# Altium schematic sheet keyboard.SchDoc
size A1
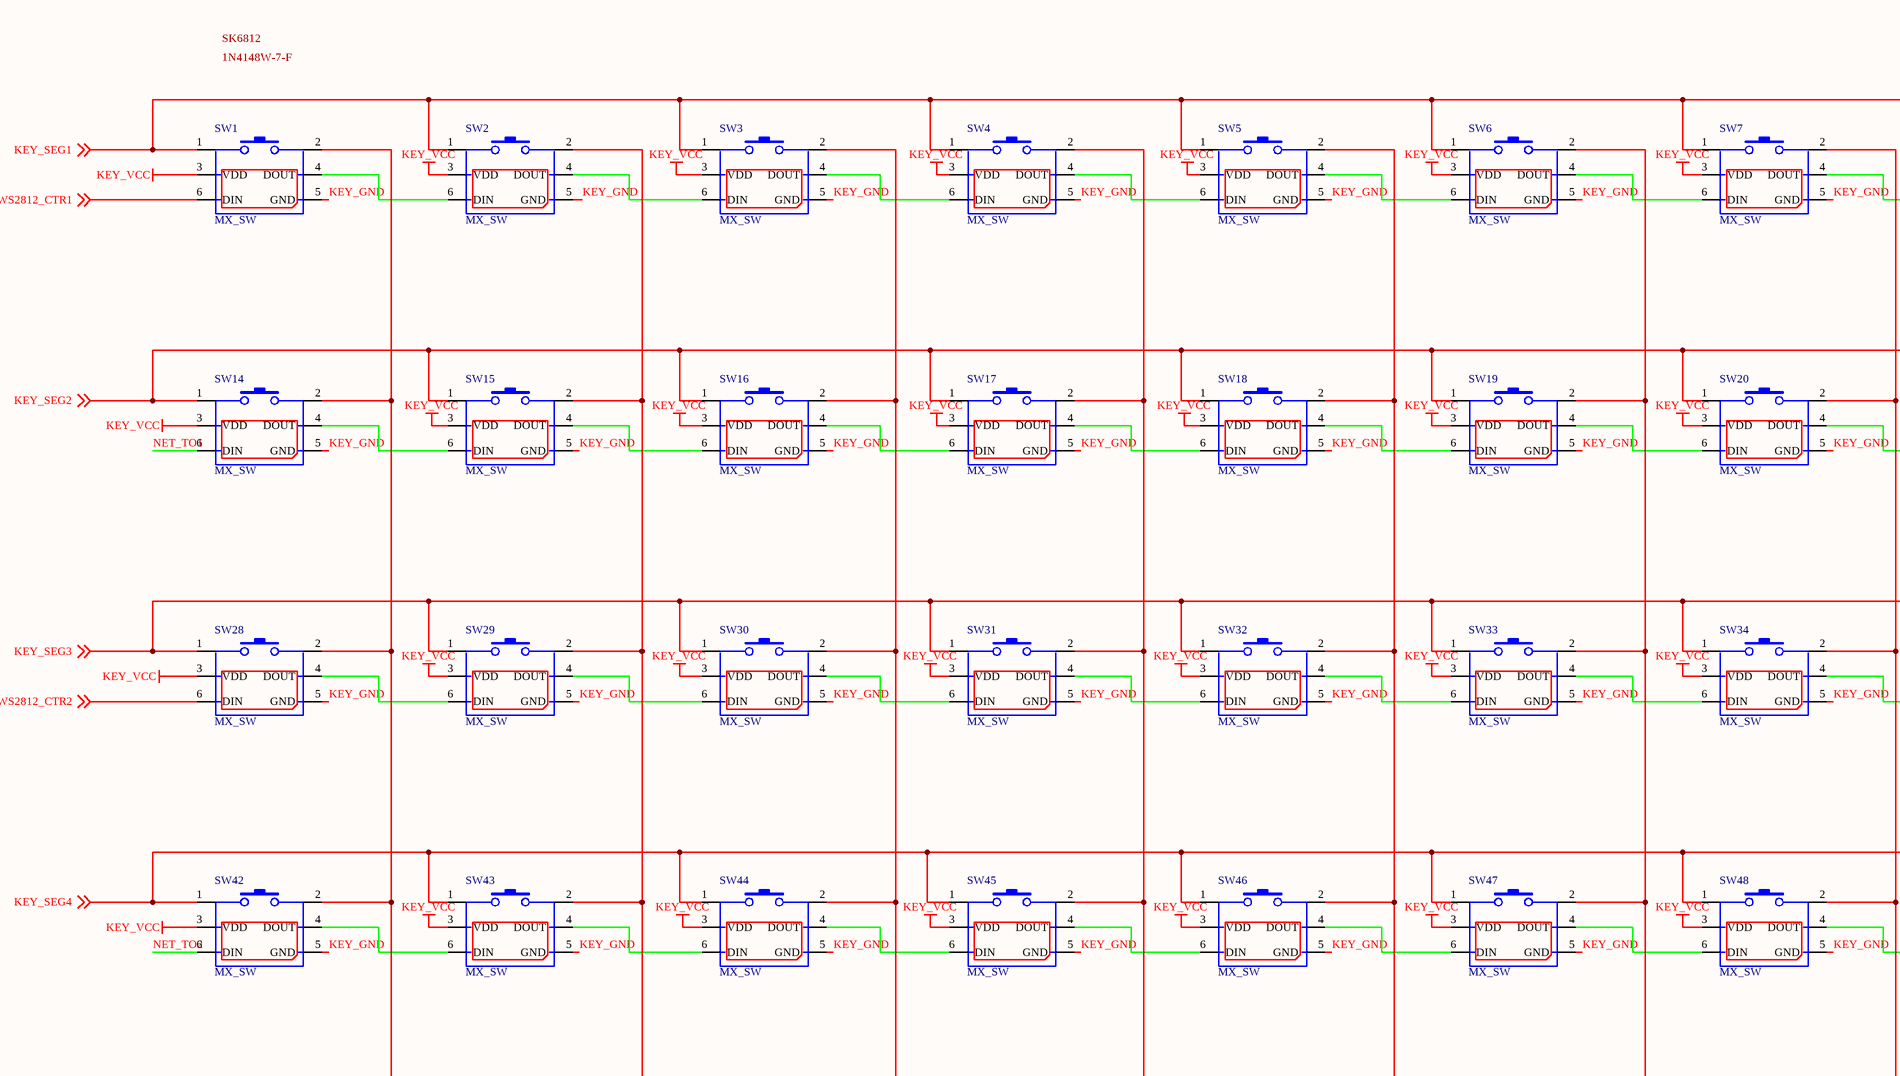
[diagram p0: keyboard.SchDoc, top left]
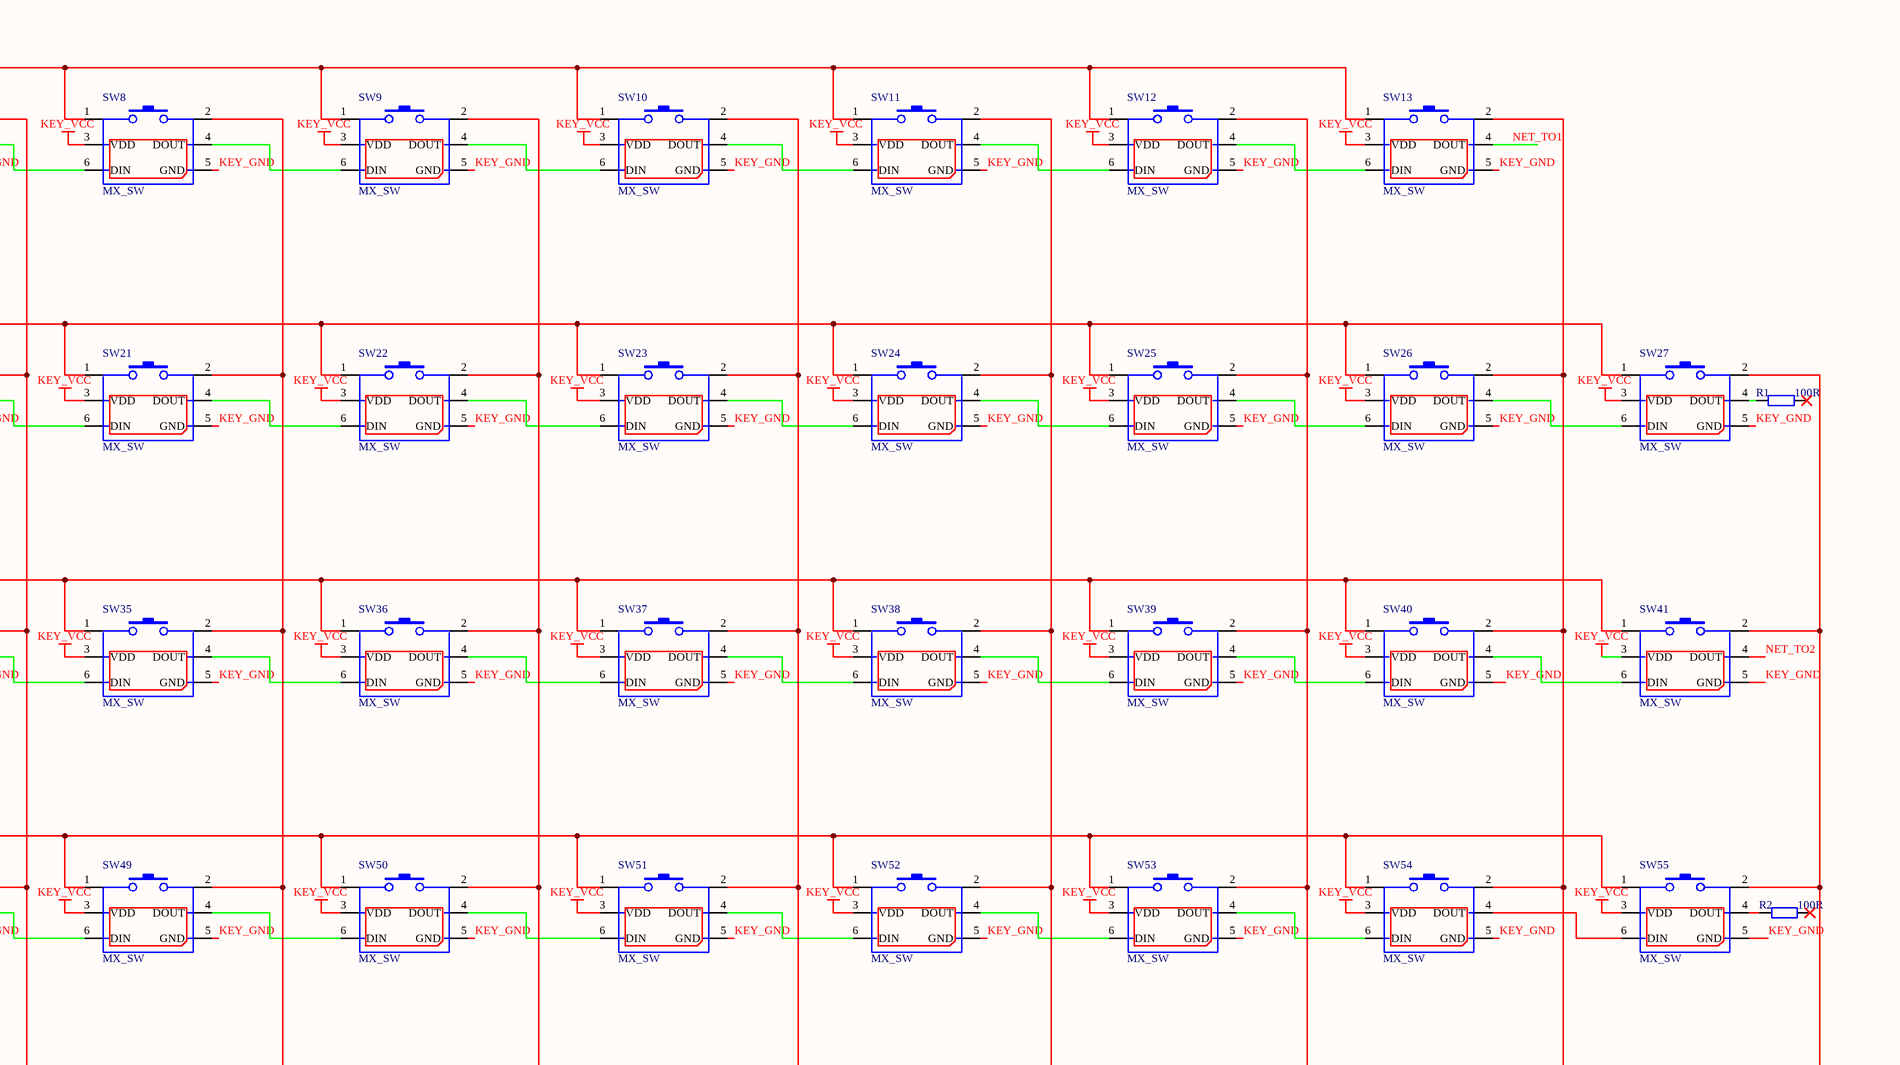
[diagram p1: keyboard.SchDoc, top right]
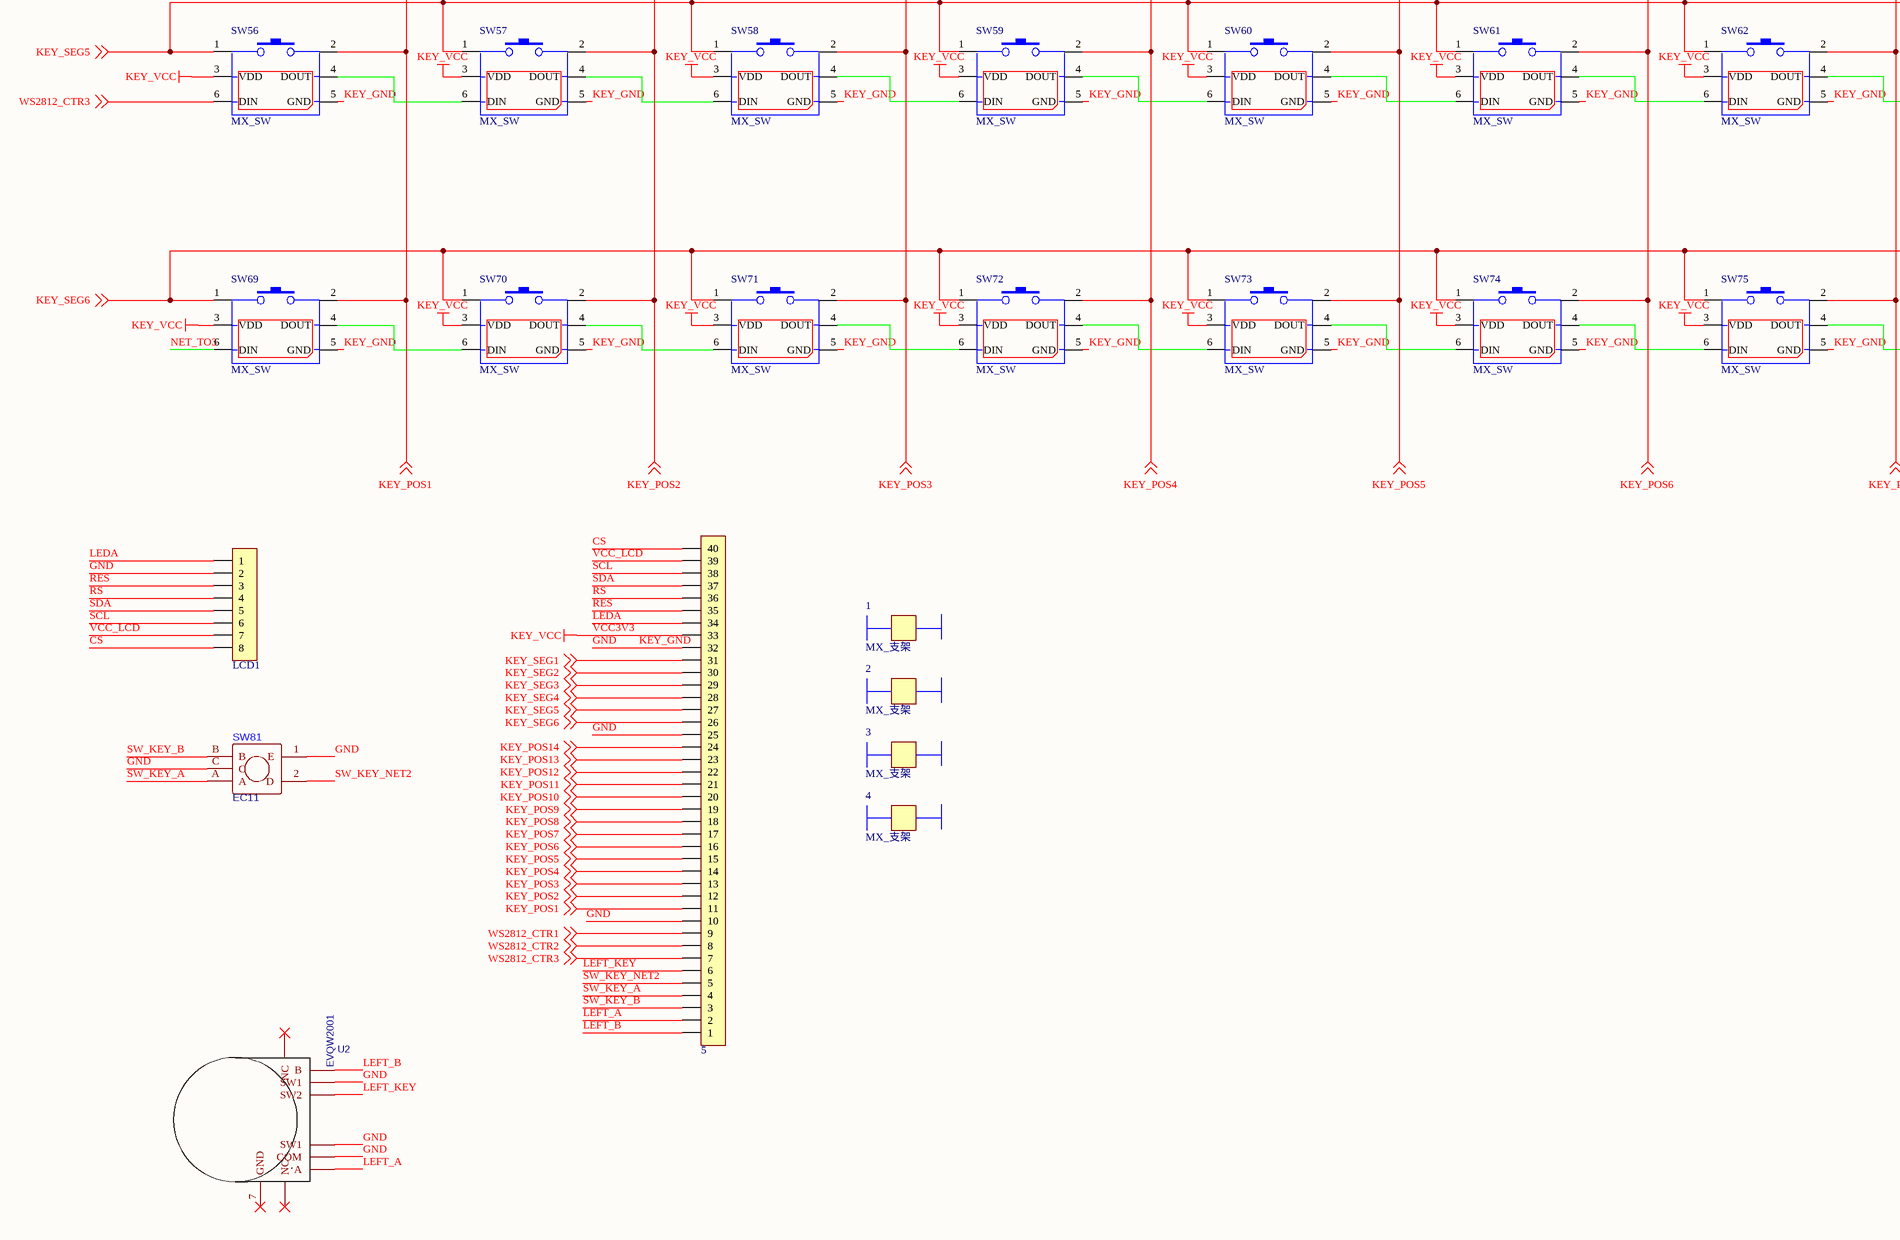
[diagram p2: keyboard.SchDoc, bottom left]
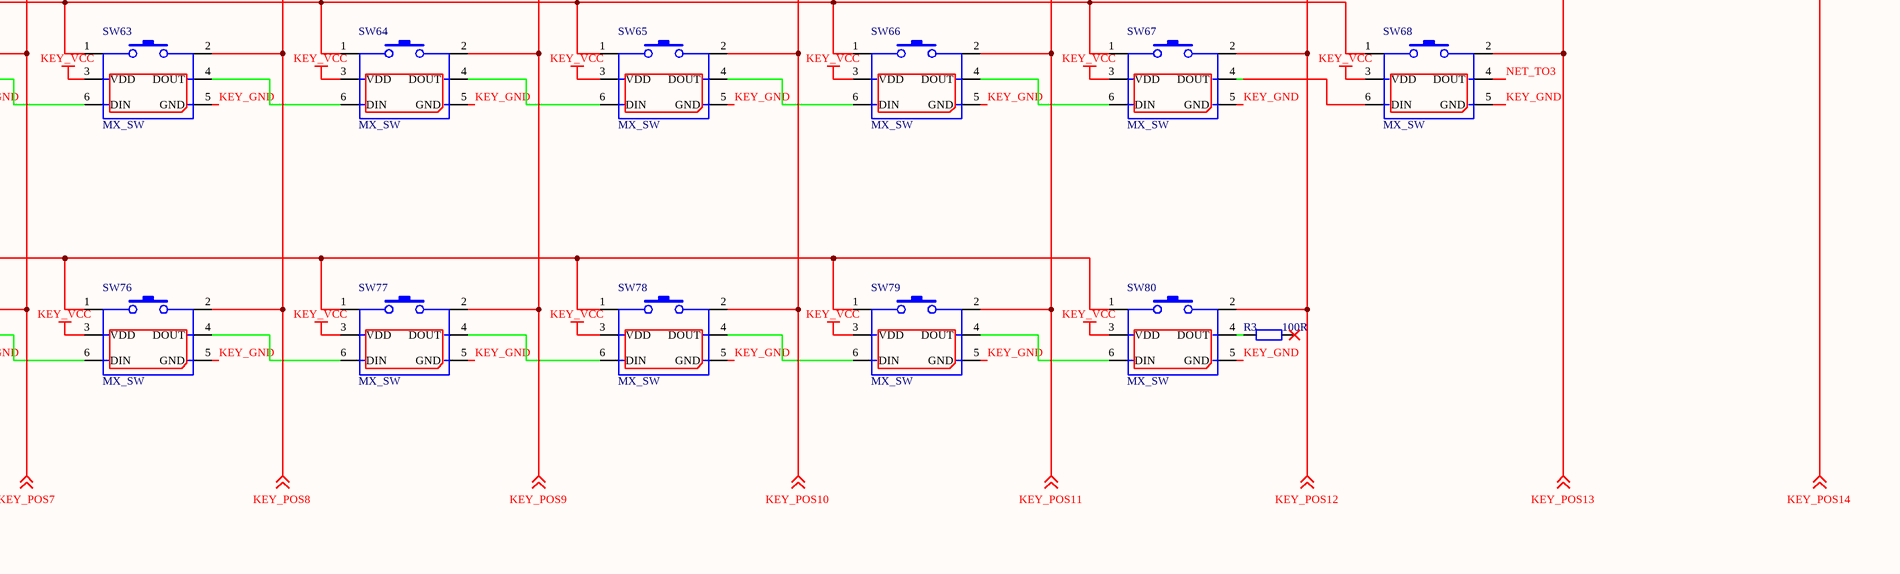
[diagram p3: keyboard.SchDoc, bottom right]

## Parts
1  MX_支架  [1x2]
2  MX_支架  [1x2]
3  MX_支架  [1x2]
4  MX_支架  [1x2]
5  FPC1.0-40P  [FPC0.5 2H-WS-40P]  (value not drawn)
LCD1  FPC1.0-8P  [FPC0.5 2H-WS-8P]  (value not drawn)
R1  100R  [R 0805_M]
R2  100R  [R 0805_M]
R3  100R  [R 0805_M]
SW1  MX_SW  [MX_G_Pro]
SW2  MX_SW  [MX_G_Pro]
SW3  MX_SW  [MX_G_Pro]
SW4  MX_SW  [MX_G_Pro]
SW5  MX_SW  [MX_G_Pro]
SW6  MX_SW  [MX_G_Pro]
SW7  MX_SW  [MX_G_Pro]
SW8  MX_SW  [MX_G_Pro]
SW9  MX_SW  [MX_G_Pro]
SW10  MX_SW  [MX_G_Pro]
SW11  MX_SW  [MX_G_Pro]
SW12  MX_SW  [MX_G_Pro]
SW13  MX_SW  [MX_G_Pro]
SW14  MX_SW  [MX_G_Pro]
SW15  MX_SW  [MX_G_Pro]
SW16  MX_SW  [MX_G_Pro]
SW17  MX_SW  [MX_G_Pro]
SW18  MX_SW  [MX_G_Pro]
SW19  MX_SW  [MX_G_Pro]
SW20  MX_SW  [MX_G_Pro]
SW21  MX_SW  [MX_G_Pro]
SW22  MX_SW  [MX_G_Pro]
SW23  MX_SW  [MX_G_Pro]
SW24  MX_SW  [MX_G_Pro]
SW25  MX_SW  [MX_G_Pro]
SW26  MX_SW  [MX_G_Pro]
SW27  MX_SW  [MX_G_Pro_Backspace]
SW28  MX_SW  [MX_G_Pro_MX_Tab]
SW29  MX_SW  [MX_G_Pro]
SW30  MX_SW  [MX_G_Pro]
SW31  MX_SW  [MX_G_Pro]
SW32  MX_SW  [MX_G_Pro]
SW33  MX_SW  [MX_G_Pro]
SW34  MX_SW  [MX_G_Pro]
SW35  MX_SW  [MX_G_Pro]
SW36  MX_SW  [MX_G_Pro]
SW37  MX_SW  [MX_G_Pro]
SW38  MX_SW  [MX_G_Pro]
SW39  MX_SW  [MX_G_Pro]
SW40  MX_SW  [MX_G_Pro]
SW41  MX_SW  [MX_G_Pro_MX_Tab]
SW42  MX_SW  [MX_G_Pro_CapsLock]
SW43  MX_SW  [MX_G_Pro]
SW44  MX_SW  [MX_G_Pro]
SW45  MX_SW  [MX_G_Pro]
SW46  MX_SW  [MX_G_Pro]
SW47  MX_SW  [MX_G_Pro]
SW48  MX_SW  [MX_G_Pro]
SW49  MX_SW  [MX_G_Pro]
SW50  MX_SW  [MX_G_Pro]
SW51  MX_SW  [MX_G_Pro]
SW52  MX_SW  [MX_G_Pro]
SW53  MX_SW  [MX_G_Pro]
SW54  MX_SW  [MX_G_Pro_MX_左Shift(Enter)]
SW55  MX_SW  [MX_G_Pro]
SW56  MX_SW  [MX_G_Pro_MX_左Shift(Enter)]
SW57  MX_SW  [MX_G_Pro]
SW58  MX_SW  [MX_G_Pro]
SW59  MX_SW  [MX_G_Pro]
SW60  MX_SW  [MX_G_Pro]
SW61  MX_SW  [MX_G_Pro]
SW62  MX_SW  [MX_G_Pro]
SW63  MX_SW  [MX_G_Pro]
SW64  MX_SW  [MX_G_Pro]
SW65  MX_SW  [MX_G_Pro]
SW66  MX_SW  [MX_G_Pro]
SW67  MX_SW  [MX_G_Pro_MX_右Shift]
SW68  MX_SW  [MX_G_Pro]
SW69  MX_SW  [MX_G_Pro_Ctrl(Win)(Alt)]
SW70  MX_SW  [MX_G_Pro_Ctrl(Win)(Alt)]
SW71  MX_SW  [MX_G_Pro_Ctrl(Win)(Alt)]
SW72  MX_SW  [MX_G_Pro_MX_空格]
SW73  MX_SW  [MX_G_Pro_Ctrl(Win)(Alt)]
SW74  MX_SW  [MX_G_Pro_Ctrl(Win)(Alt)]
SW75  MX_SW  [MX_G_Pro_Ctrl(Win)(Alt)]
SW76  MX_SW  [MX_G_Pro_Ctrl(Win)(Alt)]
SW77  MX_SW  [MX_G_Pro]
SW78  MX_SW  [MX_G_Pro]
SW79  MX_SW  [MX_G_Pro]
SW80  MX_SW  [MX_G_Pro]
SW81  EC11  [BOURNS_PEC11R-4XXXF-SXXXX]
U2  EVQW2001  [EVQWK2001 - duplicate]

## Nets
VCC3V3: 5.33 SW1.3(VDD) SW2.3(VDD) SW3.3(VDD) SW4.3(VDD) SW5.3(VDD) SW6.3(VDD) SW7.3(VDD) SW8.3(VDD) SW9.3(VDD) SW10.3(VDD) SW11.3(VDD) SW12.3(VDD) SW13.3(VDD) SW14.3(VDD) SW15.3(VDD) SW16.3(VDD) SW17.3(VDD) SW18.3(VDD) SW19.3(VDD) SW20.3(VDD) SW21.3(VDD) SW22.3(VDD) SW23.3(VDD) SW24.3(VDD) SW25.3(VDD) SW26.3(VDD) SW27.3(VDD) SW28.3(VDD) SW29.3(VDD) SW30.3(VDD) SW31.3(VDD) SW32.3(VDD) SW33.3(VDD) SW34.3(VDD) SW35.3(VDD) SW36.3(VDD) SW37.3(VDD) SW38.3(VDD) SW39.3(VDD) SW40.3(VDD) SW41.3(VDD) SW42.3(VDD) SW43.3(VDD) SW44.3(VDD) SW45.3(VDD) SW46.3(VDD) SW47.3(VDD) SW48.3(VDD) SW49.3(VDD) SW50.3(VDD) SW51.3(VDD) SW52.3(VDD) SW53.3(VDD) SW54.3(VDD) SW55.3(VDD) SW56.3(VDD) SW57.3(VDD) SW58.3(VDD) SW59.3(VDD) SW60.3(VDD) SW61.3(VDD) SW62.3(VDD) SW63.3(VDD) SW64.3(VDD) SW65.3(VDD) SW66.3(VDD) SW67.3(VDD) SW68.3(VDD) SW69.3(VDD) SW70.3(VDD) SW71.3(VDD) SW72.3(VDD) SW73.3(VDD) SW74.3(VDD) SW75.3(VDD) SW76.3(VDD) SW77.3(VDD) SW78.3(VDD) SW79.3(VDD) SW80.3(VDD)  [also labelled KEY_VCC]
CS: 5.40 LCD1.8
GND: 5.10 5.25 5.32 LCD1.2 SW1.5(GND) SW2.5(GND) SW3.5(GND) SW4.5(GND) SW5.5(GND) SW6.5(GND) SW7.5(GND) SW8.5(GND) SW9.5(GND) SW10.5(GND) SW11.5(GND) SW12.5(GND) SW13.5(GND) SW14.5(GND) SW15.5(GND) SW16.5(GND) SW17.5(GND) SW18.5(GND) SW19.5(GND) SW20.5(GND) SW21.5(GND) SW22.5(GND) SW23.5(GND) SW24.5(GND) SW25.5(GND) SW26.5(GND) SW27.5(GND) SW28.5(GND) SW29.5(GND) SW30.5(GND) SW31.5(GND) SW32.5(GND) SW33.5(GND) SW34.5(GND) SW35.5(GND) SW36.5(GND) SW37.5(GND) SW38.5(GND) SW39.5(GND) SW40.5(GND) SW41.5(GND) SW42.5(GND) SW43.5(GND) SW44.5(GND) SW45.5(GND) SW46.5(GND) SW47.5(GND) SW48.5(GND) SW49.5(GND) SW50.5(GND) SW51.5(GND) SW52.5(GND) SW53.5(GND) SW54.5(GND) SW55.5(GND) SW56.5(GND) SW57.5(GND) SW58.5(GND) SW59.5(GND) SW60.5(GND) SW61.5(GND) SW62.5(GND) SW63.5(GND) SW64.5(GND) SW65.5(GND) SW66.5(GND) SW67.5(GND) SW68.5(GND) SW69.5(GND) SW70.5(GND) SW71.5(GND) SW72.5(GND) SW73.5(GND) SW74.5(GND) SW75.5(GND) SW76.5(GND) SW77.5(GND) SW78.5(GND) SW79.5(GND) SW80.5(GND) SW81.1(E) SW81.C U2.2(SW1) U2.4(SW1) U2.5(COM)  [also labelled KEY_GND]
KEY_POS1: 5.11 SW1.2 SW14.2 SW28.2 SW42.2 SW56.2 SW69.2 ; off-sheet KEY_POS1
KEY_POS2: 5.12 SW2.2 SW15.2 SW29.2 SW43.2 SW57.2 SW70.2 ; off-sheet KEY_POS2
KEY_POS3: 5.13 SW3.2 SW16.2 SW30.2 SW44.2 SW58.2 SW71.2 ; off-sheet KEY_POS3
KEY_POS4: 5.14 SW4.2 SW17.2 SW31.2 SW45.2 SW59.2 SW72.2 ; off-sheet KEY_POS4
KEY_POS5: 5.15 SW5.2 SW18.2 SW32.2 SW46.2 SW60.2 SW73.2 ; off-sheet KEY_POS5
KEY_POS6: 5.16 SW6.2 SW19.2 SW33.2 SW47.2 SW61.2 SW74.2 ; off-sheet KEY_POS6
KEY_POS7: 5.17 SW7.2 SW20.2 SW34.2 SW48.2 SW62.2 SW75.2 ; off-sheet KEY_POS7
KEY_POS8: 5.18 SW8.2 SW21.2 SW35.2 SW49.2 SW63.2 SW76.2 ; off-sheet KEY_POS8
KEY_POS9: 5.19 SW9.2 SW22.2 SW36.2 SW50.2 SW64.2 SW77.2 ; off-sheet KEY_POS9
KEY_POS10: 5.20 SW10.2 SW23.2 SW37.2 SW51.2 SW65.2 SW78.2 ; off-sheet KEY_POS10
KEY_POS11: 5.21 SW11.2 SW24.2 SW38.2 SW52.2 SW66.2 SW79.2 ; off-sheet KEY_POS11
KEY_POS12: 5.22 SW12.2 SW25.2 SW39.2 SW53.2 SW67.2 SW80.2 ; off-sheet KEY_POS12
KEY_POS13: 5.23 SW13.2 SW26.2 SW40.2 SW54.2 SW68.2 ; off-sheet KEY_POS13
KEY_POS14: 5.24 SW27.2 SW41.2 SW55.2 ; off-sheet KEY_POS14
KEY_SEG1: 5.31 SW1.1 SW2.1 SW3.1 SW4.1 SW5.1 SW6.1 SW7.1 SW8.1 SW9.1 SW10.1 SW11.1 SW12.1 SW13.1 ; off-sheet KEY_SEG1
KEY_SEG2: 5.30 SW14.1 SW15.1 SW16.1 SW17.1 SW18.1 SW19.1 SW20.1 SW21.1 SW22.1 SW23.1 SW24.1 SW25.1 SW26.1 SW27.1 ; off-sheet KEY_SEG2
KEY_SEG3: 5.29 SW28.1 SW29.1 SW30.1 SW31.1 SW32.1 SW33.1 SW34.1 SW35.1 SW36.1 SW37.1 SW38.1 SW39.1 SW40.1 SW41.1 ; off-sheet KEY_SEG3
KEY_SEG4: 5.28 SW42.1 SW43.1 SW44.1 SW45.1 SW46.1 SW47.1 SW48.1 SW49.1 SW50.1 SW51.1 SW52.1 SW53.1 SW54.1 SW55.1 ; off-sheet KEY_SEG4
KEY_SEG5: 5.27 SW56.1 SW57.1 SW58.1 SW59.1 SW60.1 SW61.1 SW62.1 SW63.1 SW64.1 SW65.1 SW66.1 SW67.1 SW68.1 ; off-sheet KEY_SEG5
KEY_SEG6: 5.26 SW69.1 SW70.1 SW71.1 SW72.1 SW73.1 SW74.1 SW75.1 SW76.1 SW77.1 SW78.1 SW79.1 SW80.1 ; off-sheet KEY_SEG6
LEDA: 5.34 LCD1.1
LEFT_A: 5.2 U2.6(A)
LEFT_B: 5.1 U2.1(B)
LEFT_KEY: 5.6 U2.3(SW2)
NET_TO1: SW13.4(DOUT) SW14.6(DIN)
NET_TO2: SW41.4(DOUT) SW42.6(DIN)
NET_TO3: SW68.4(DOUT) SW69.6(DIN)
RES: 5.35 LCD1.3
RS: 5.36 LCD1.4
SCL: 5.38 LCD1.6
SDA: 5.37 LCD1.5
SW_KEY_A: 5.4 SW81.A
SW_KEY_B: 5.3 SW81.B
SW_KEY_NET2: 5.5 SW81.2(D)
VCC_LCD: 5.39 LCD1.7
WS2812_CTR1: 5.9 SW1.6(DIN) ; off-sheet WS2812_CTR1
WS2812_CTR2: 5.8 SW28.6(DIN) ; off-sheet WS2812_CTR2
WS2812_CTR3: 5.7 SW56.6(DIN) ; off-sheet WS2812_CTR3
NetR1_1: R1.1 SW27.4(DOUT)
NetR2_1: R2.1 SW55.4(DOUT)
NetR3_1: R3.1 SW80.4(DOUT)
NetSW1_4: SW1.4(DOUT) SW2.6(DIN)
NetSW2_4: SW2.4(DOUT) SW3.6(DIN)
NetSW3_4: SW3.4(DOUT) SW4.6(DIN)
NetSW4_4: SW4.4(DOUT) SW5.6(DIN)
NetSW5_4: SW5.4(DOUT) SW6.6(DIN)
NetSW6_4: SW6.4(DOUT) SW7.6(DIN)
NetSW7_4: SW7.4(DOUT) SW8.6(DIN)
NetSW8_4: SW8.4(DOUT) SW9.6(DIN)
NetSW9_4: SW9.4(DOUT) SW10.6(DIN)
NetSW10_4: SW10.4(DOUT) SW11.6(DIN)
NetSW11_4: SW11.4(DOUT) SW12.6(DIN)
NetSW12_4: SW12.4(DOUT) SW13.6(DIN)
NetSW14_4: SW14.4(DOUT) SW15.6(DIN)
NetSW15_4: SW15.4(DOUT) SW16.6(DIN)
NetSW16_4: SW16.4(DOUT) SW17.6(DIN)
NetSW17_4: SW17.4(DOUT) SW18.6(DIN)
NetSW18_4: SW18.4(DOUT) SW19.6(DIN)
NetSW19_4: SW19.4(DOUT) SW20.6(DIN)
NetSW20_4: SW20.4(DOUT) SW21.6(DIN)
NetSW21_4: SW21.4(DOUT) SW22.6(DIN)
NetSW22_4: SW22.4(DOUT) SW23.6(DIN)
NetSW23_4: SW23.4(DOUT) SW24.6(DIN)
NetSW24_4: SW24.4(DOUT) SW25.6(DIN)
NetSW25_4: SW25.4(DOUT) SW26.6(DIN)
NetSW26_4: SW26.4(DOUT) SW27.6(DIN)
NetSW28_4: SW28.4(DOUT) SW29.6(DIN)
NetSW29_4: SW29.4(DOUT) SW30.6(DIN)
NetSW30_4: SW30.4(DOUT) SW31.6(DIN)
NetSW31_4: SW31.4(DOUT) SW32.6(DIN)
NetSW32_4: SW32.4(DOUT) SW33.6(DIN)
NetSW33_4: SW33.4(DOUT) SW34.6(DIN)
NetSW34_4: SW34.4(DOUT) SW35.6(DIN)
NetSW35_4: SW35.4(DOUT) SW36.6(DIN)
NetSW36_4: SW36.4(DOUT) SW37.6(DIN)
NetSW37_4: SW37.4(DOUT) SW38.6(DIN)
NetSW38_4: SW38.4(DOUT) SW39.6(DIN)
NetSW39_4: SW39.4(DOUT) SW40.6(DIN)
NetSW40_4: SW40.4(DOUT) SW41.6(DIN)
NetSW42_4: SW42.4(DOUT) SW43.6(DIN)
NetSW43_4: SW43.4(DOUT) SW44.6(DIN)
NetSW44_4: SW44.4(DOUT) SW45.6(DIN)
NetSW45_4: SW45.4(DOUT) SW46.6(DIN)
NetSW46_4: SW46.4(DOUT) SW47.6(DIN)
NetSW47_4: SW47.4(DOUT) SW48.6(DIN)
NetSW48_4: SW48.4(DOUT) SW49.6(DIN)
NetSW49_4: SW49.4(DOUT) SW50.6(DIN)
NetSW50_4: SW50.4(DOUT) SW51.6(DIN)
NetSW51_4: SW51.4(DOUT) SW52.6(DIN)
NetSW52_4: SW52.4(DOUT) SW53.6(DIN)
NetSW53_4: SW53.4(DOUT) SW54.6(DIN)
NetSW54_4: SW54.4(DOUT) SW55.6(DIN)
NetSW56_4: SW56.4(DOUT) SW57.6(DIN)
NetSW57_4: SW57.4(DOUT) SW58.6(DIN)
NetSW58_4: SW58.4(DOUT) SW59.6(DIN)
NetSW59_4: SW59.4(DOUT) SW60.6(DIN)
NetSW60_4: SW60.4(DOUT) SW61.6(DIN)
NetSW61_4: SW61.4(DOUT) SW62.6(DIN)
NetSW62_4: SW62.4(DOUT) SW63.6(DIN)
NetSW63_4: SW63.4(DOUT) SW64.6(DIN)
NetSW64_4: SW64.4(DOUT) SW65.6(DIN)
NetSW65_4: SW65.4(DOUT) SW66.6(DIN)
NetSW66_4: SW66.4(DOUT) SW67.6(DIN)
NetSW67_4: SW67.4(DOUT) SW68.6(DIN)
NetSW69_4: SW69.4(DOUT) SW70.6(DIN)
NetSW70_4: SW70.4(DOUT) SW71.6(DIN)
NetSW71_4: SW71.4(DOUT) SW72.6(DIN)
NetSW72_4: SW72.4(DOUT) SW73.6(DIN)
NetSW73_4: SW73.4(DOUT) SW74.6(DIN)
NetSW74_4: SW74.4(DOUT) SW75.6(DIN)
NetSW75_4: SW75.4(DOUT) SW76.6(DIN)
NetSW76_4: SW76.4(DOUT) SW77.6(DIN)
NetSW77_4: SW77.4(DOUT) SW78.6(DIN)
NetSW78_4: SW78.4(DOUT) SW79.6(DIN)
NetSW79_4: SW79.4(DOUT) SW80.6(DIN)

Not connected (* = marked no-connect by the designer): R1 2*; R2 2*; R3 2*; U2 7(GND)* 8(NC)*

## Notes on the sheet
- SK6812
- 1N4148W-7-F
- Title
- Size:
- Date:
- File:
- A1
- Number:
- Time:
- Revision:
- Sheet
- of

## Library data of the parts
5 = FPC-40P: FPC连接器; 版权归属: 黎明电子style; BOM名称: FPC连接器; 学习资源: https://lmdzstyle.taobao.com/
LCD1 = FPC-8P: FPC连接器; 版权归属: 黎明电子style; BOM名称: FPC连接器; 学习资源: https://lmdzstyle.taobao.com/
R1-R3 = R: 贴片电阻
SW1-SW80 = MX_SW-7: with Fixation pins  1-Pole w/Diode
U2 = EVQW2001: Contributor: jam_dan; spicePre: U; spiceSymbolName: EVQW2001